# EasyEDA Pro project zhuban.epro, board PCB4
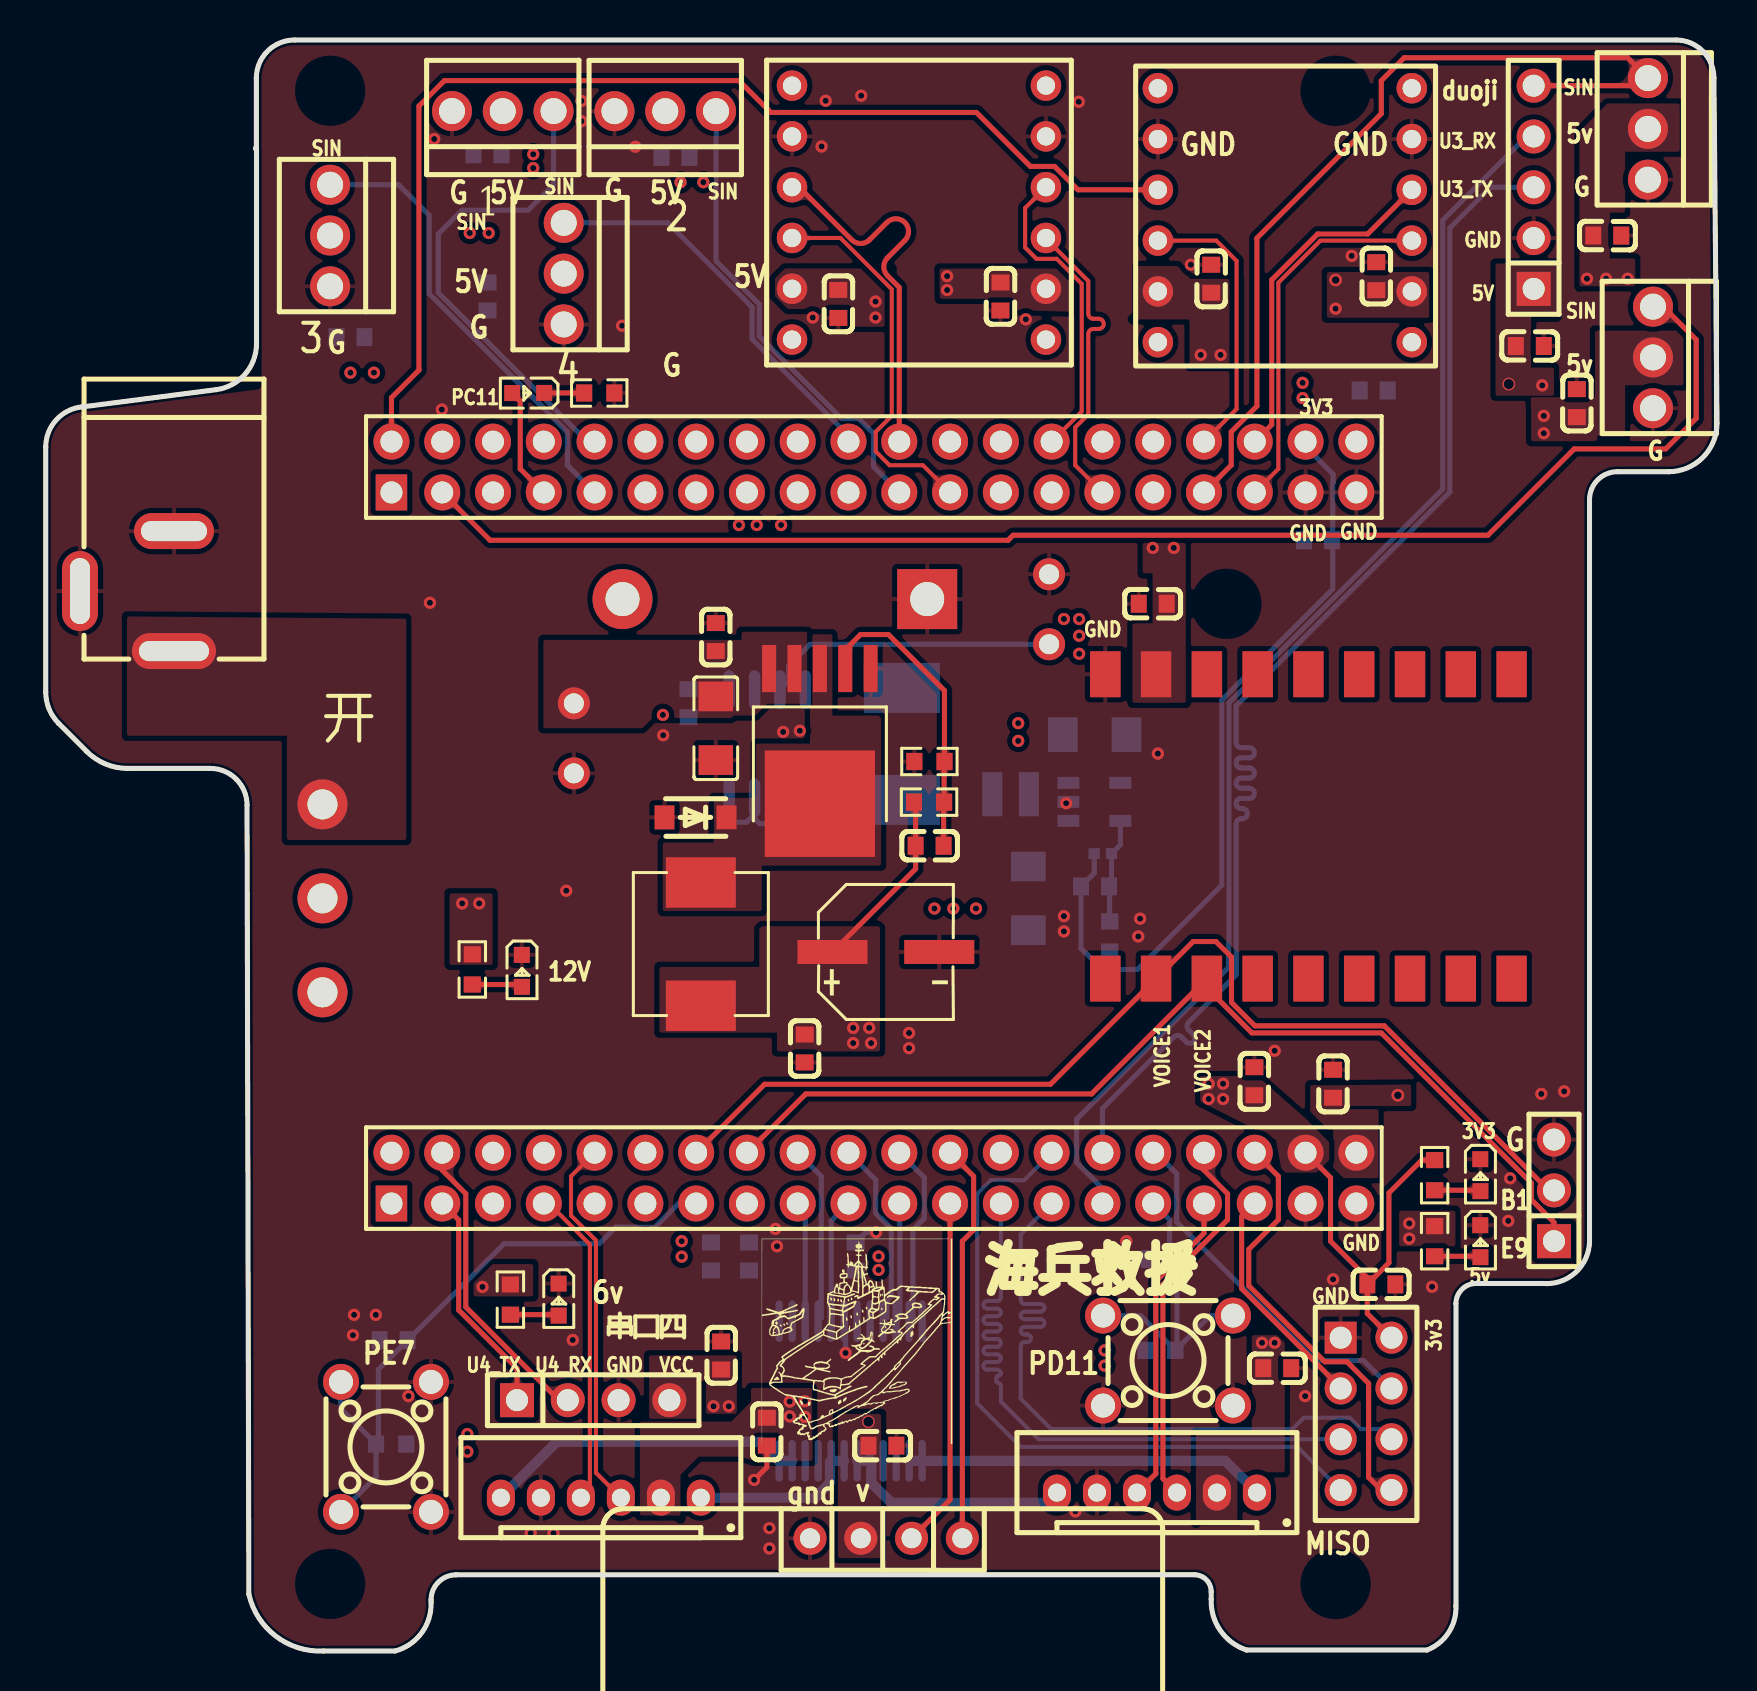
[diagram p5: board, top side]
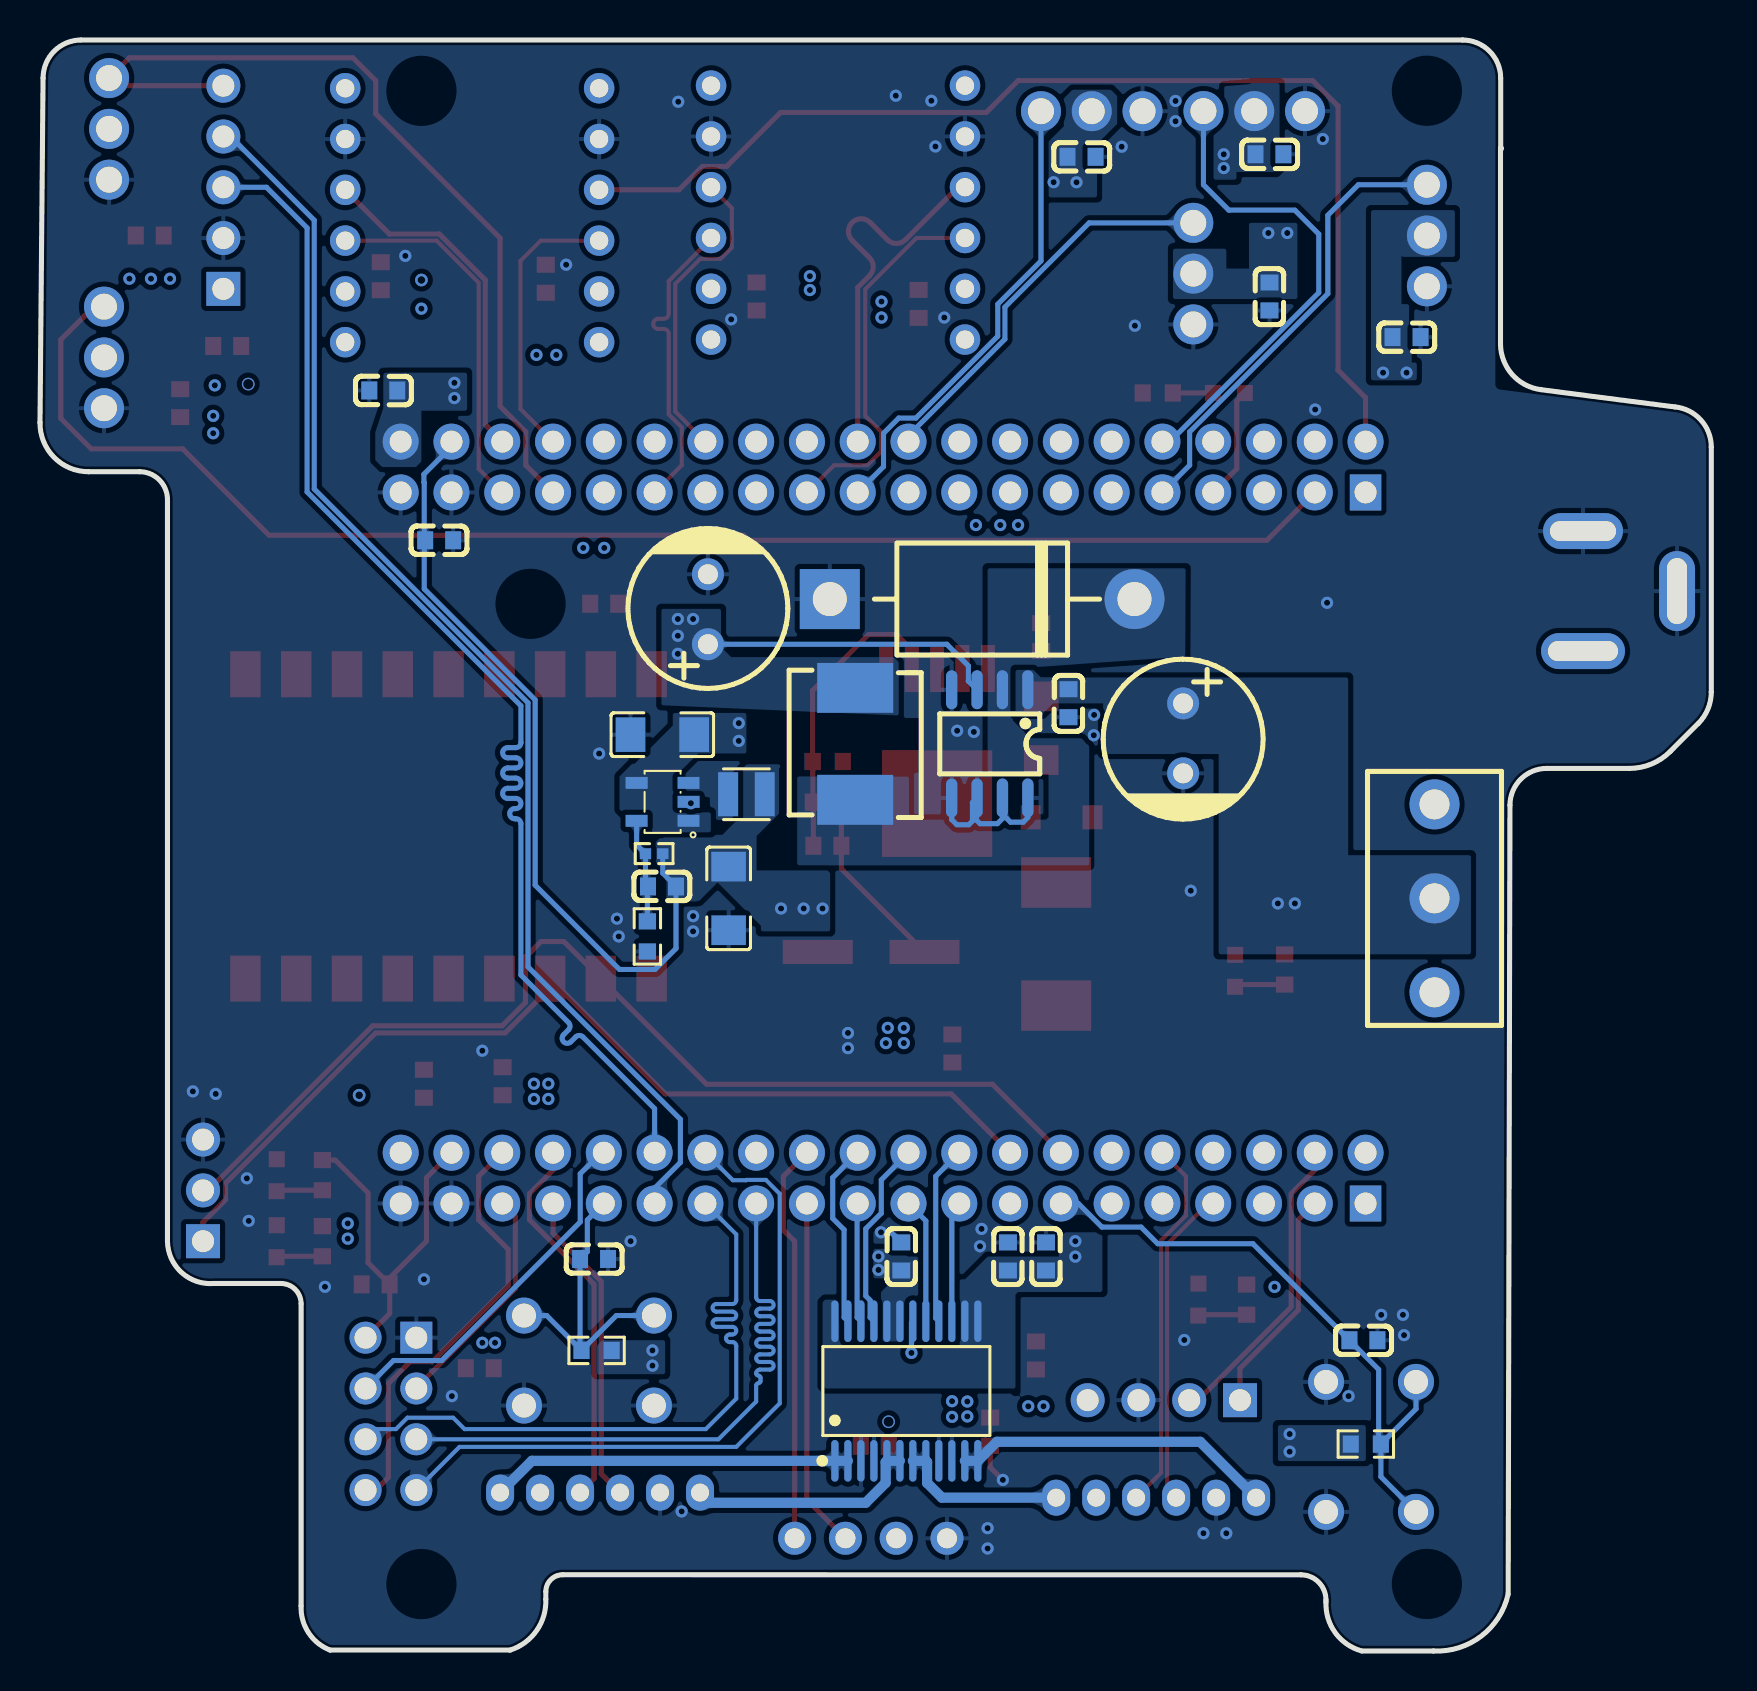
[diagram p6: board, bottom side, seen from below]

Outline 83.59 x 80.57 mm; copper layers: Top Layer, Inner1, Inner2, Bottom Layer. Coordinates in mm from the lower left corner of the outline.
Outline path: 0,60.21 0,47.96 arc(0.17,47.11) 0.65,46.39 2.05,44.98 arc(2.99,44.36) 4.1,44.14 8.23,44.14 arc(9.53,43.6) 10.07,42.3 10.16,2.84 arc(11.51,0.74) 13.89,0 17.48,0 arc(18.8,0.9) 19.27,2.43 19.27,2.56 arc(19.64,3.44) 20.53,3.81 57.45,3.81 arc(58.05,3.57) 58.29,2.97 58.29,2.59 arc(58.76,1.02) 60.07,0.05 69.09,0.05 arc(70.16,0.92) 70.53,2.25 70.53,17.37 arc(70.83,18.08) 71.55,18.38 74.89,18.38 arc(76.51,18.92) 77.22,20.48 77.22,57.58 arc(77.63,58.57) 78.61,58.98 81.17,58.98 arc(82.89,59.69) 83.59,61.42 83.44,78.66 arc(82.88,80.01) 81.53,80.57 12.44,80.57 arc(11.09,80) 10.53,78.65 10.53,75.17 arc(10.49,75.13) 10.54,75.1 10.54,65.37 arc(9.97,63.85) 8.52,63.08 1.83,62.22 arc(0.52,61.56) 0,60.21
Stack: Top Layer 0.035mm 外层铜厚1oz / Dielectric1 0.2104mm 7628 RC49% 8.6mil / Inner1 0.0152mm 内层铜厚 / Dielectric2 1.065mm 1.1mm H/HOZ Copper / Inner2 0.0152mm 内层铜厚 / Dielectric3 0.2104mm 7628 RC49% 8.6mil / Bottom Layer 0.035mm 外层铜厚1oz

## Design rules (mm)
template: 自定义配置
spacing copperThickness1oz (default): track to track 0.102, other pairs 0.152 to 0.3
spacing copperThickness2oz: track to track 0.203, other pairs 0.152 to 0.3
track width copperThickness1oz (default): min 0.127, default 0.254, max 2.54
track width copperThickness2oz: min 0.203, default 0.254, max 2.54
differential pair differentialPair (default): width min 0.127, default 0.254, max 2.54; gap min 0.152, default 0.152
via viaSize (default): diameter min 0.5, default 0.61, max 10; hole min 0.3, default 0.305, max 6.3
net 12V uses ASD
net 5V2A uses AS
net 3V3 uses ASD
net $3N5292 uses ASD
net $3N121 uses AS
net $3N6658 uses ASD
net $3N5291 uses ASD
net 6V uses ASD
net $3N20136 uses ASD

## Placement (name value [footprint] x y rotation side)
C7  1uF  [C0603]  32.15 47.4 90 bottom
C8  180uF  [CAP-TH_BD8.0-P3.50-D0.6-FD]  50.19 52.1 90 bottom
C9  470uF  [CAP-TH_BD8.0-P3.50-D0.6-FD_1]  26.42 45.64 270 bottom
C25  22uF  [C1206]  52.47 45.83 180 bottom
C26  22uF  [C1206]  49.15 37.64 270 bottom
C27  100pF  [C0603]  52.48 38.24 180 bottom
C33  100nF  [C0603]  35.18 19.73 90 bottom
C34  10uF  [C0603]  33.27 19.73 90 bottom
C35  100nF  [C0603]  40.51 19.73 90 bottom
C39  100nF  [C0603]  58.29 68.63 90 top
C40  100nF  [C0603]  74.23 65.26 0 top
C42  100nF  [C0603]  22.1 74.85 0 bottom
C43  100nF  [C0603]  66.55 68.75 270 top
C44  100nF  [C0603]  31.5 74.72 0 bottom
C45  100nF  [C0603]  22.1 67.74 90 bottom
C46  100nF  [C0603]  15.24 65.71 0 bottom
C48  100nF  [C0603]  61.59 14.14 180 top
C49  100nF  [C0603]  36.07 10.97 90 top
C55  100nF  [C0603]  17.4 15.54 0 bottom
C56  100nF  [C0603]  55.88 19.61 0 bottom
C58  100nF  [C0603]  47.75 67.74 270 top
C59  100nF  [C0603]  39.64 67.37 270 top
C64  100nF  [C0603]  41.85 10.27 180 top
C65  100nF  [C0603]  33.78 14.78 270 top
C66  100nF  [C0603]  66.8 18.34 0 top
C67  100nF  [C0603]  64.39 28.37 90 top
C68  100nF  [C0603]  60.45 28.5 90 top
C69  100nF  [C0603]  66.42 63.04 0 bottom
C70  100nF  [C0603]  63.63 55.55 180 bottom
C71  100nF  [C0603]  55.37 52.37 0 top
C72  100uF  [C1206]  33.51 46.15 90 top
C73  1uF  [C0603]  33.51 50.71 270 top
C74  2.7nF  [C0603]  44.21 40.27 0 top
C75  220uF  [CAP-SMD_BD6.3-L6.6-W6.6-LS7.2-FD]  42.02 34.96 0 top
C76  1uF  [C0603]  37.96 30.13 270 top
C77  100nF  [C0603]  78.1 70.79 180 top
C78  100nF  [C0603]  76.58 62.4 270 top
CN1  PH2.0-6P  [PH2.0-6P 直针端子座]  60.58 7.92 180 top
CN3  PH2.0-6P  [PH2.0-6P 直针端子座]  32.77 7.67 180 top
CN5  640456-3  [CONN-TH_640456-3]  14.22 70.79 90 top
CN6  640456-3  [CONN-TH_640456-3]  25.91 68.88 90 top
CN7  640456-3  [CONN-TH_640456-3]  22.86 77.01 0 top
CN8  640456-3  [CONN-TH_640456-3]  30.99 77.01 0 top
CN14  640456-3  [CONN-TH_640456-3]  80.14 76.12 90 top
CN15  640456-3  [CONN-TH_640456-3]  80.39 64.69 90 top
D1  SK32WA  [SOD-123F_L2.8-W1.8-LS3.7-RD]  32.5 41.69 180 top
DC1  DC-005-5A-2.0  [DC-IN-TH_DC-005-5A-2.0]  4.06 53.01 270 top
H2  PZ254V-11-03P  [HDR-TH_3P-P2.54-V-M]  75.44 23.03 90 top
H3  PZ254V-11-05P  [HDR-TH_5P-P2.54-V-M]  74.42 73.2 90 top
L2  68uH  [IND-SMD_L7.1-W6.6-1]  42.82 45.37 270 bottom
L3  2.2uH  [IND-SMD_L2.5-W2.0_MHCD252012A]  48.26 42.85 180 bottom
L4  22uH  [IND-SMD_L7.0-W6.6_FXL0650]  32.77 35.35 270 top
LED1  XL-1608SURC-06  [LED0603-RD_RED]  25.65 17.57 270 top
LED3  XL-1608SURC-06  [LED0603-RD_RED]  71.75 20.49 270 top
LED9  XL-1608SURC-06  [LED0603-RD_RED]  71.75 23.8 270 top
LED10  XL-1608SURC-06  [LED0603-RD_RED]  24.13 62.91 180 top
LED11  XL-1608SURC-06  [LED0603-RD_RED]  23.82 34.01 270 top
OLED1  -  [0.96OLED_4P]  42.04 5.64 0 top
R5  10kΩ  [R0603]  69.47 20.49 270 top
R29  10kΩ  [R0603]  17.28 10.35 0 bottom
R31  450kΩ  [R0402]  52.88 39.87 180 bottom
R32  100kΩ  [R0603]  53.21 35.73 270 bottom
R45  10kΩ  [R0603]  69.47 23.8 270 top
R46  10kΩ  [R0603]  27.69 62.91 0 top
R47  10kΩ  [R0603]  55.75 15.03 180 bottom
R49  10kΩ  [R0603]  23.24 17.57 270 top
R50  2kΩ  [R0603]  44.2 44.48 0 top
R51  13kΩ  [R0603]  44.18 42.45 0 top
R52  10kΩ  [R0603]  21.34 34.08 270 top
SW4  K2-1102DP-Z4SW-04  [SW-TH_4P-L6.0-W6.0-P4.50-LS6.5]  17.02 10.21 90 top
SW5  K2-1102DP-Z4SW-04  [SW-TH_4P-L6.0-W6.0-P4.50-LS6.5]  56.13 14.53 0 top
U2  2.54-2*4  [HDR-TH_8P-P2.54-V-F-R2-C4-S2.54]  66.04 11.86 270 top
U3  XL1509-5.0E1  [SOIC-8_L5.0-W4.0-P1.27-LS6.0-BL]  36.09 45.37 0 bottom
U4  1N5820-E3/54  [DO-201AD_BD5.3-L8.4-P12.50-D1.4-FD]  36.47 52.61 180 bottom
U23  WTH01  [JY901]  43.07 71.68 180 top
U24  ME3103AM5G  [SOT-23-5_L3.0-W1.7-P0.95-LS2.8-BR]  52.45 42.47 180 bottom
U28  TB6612FNG(O,C,8,EL  [SSOP-24_L8.4-W5.8-P0.65-LS7.8-BL]  40.26 13 180 bottom
U31  PZ2.54-2*20  [HDR-TH_40P-P2.54-V-M-R2-C20-S2.54]  41.42 59.21 0 top
U32  PZ2.54-2*20  [HDR-TH_40P-P2.54-V-M-R2-C20-S2.54]  41.42 23.65 0 top
U34  JY901  [JY901#2]  64.52 69.26 180 top
U35  PM254-1-04-Z-8.5  [HDR-TH_4P-P2.54-V-F]  27.38 12.54 0 top
U36  PM254-2-09-Z-8.5  [HDR-TH_18P-P2.54-V-F-R2-C9-S2.54]  59.44 39.93 90 top
U38  -  [电源开关]  13.84 37.64 270 bottom
U39  XL4003E1  [TO-252-5_L6.5-W5.6-P1.27-LS9.5-TL]  38.72 45.75 270 top

## Footprints (pads in the part's own frame, mm; a bottom-side part is the same pattern mirrored in y, then rotated)
0.96OLED_4P
  round 1.651 hole 1.001: 1(-3.81,0) 2(-1.27,0.003) 3(1.27,0.003) 4(3.81,0.003)
C0603
  rect 0.8x0.9 smd: 1(-0.7,0) 2(0.7,0)
C1206
  rect 1.485x1.728 smd: 1(-1.593,0) 2(1.593,0)
CAP-SMD_BD6.3-L6.6-W6.6-LS7.2-FD
  rect 3.5x1.2 smd: 1(-2.67,0) 2(2.67,0)
CAP-TH_BD8.0-P3.50-D0.6-FD
  round 1.6 hole 1: 1(-1.75,0) 2(1.75,0)
CAP-TH_BD8.0-P3.50-D0.6-FD_1
  round 1.6 hole 1: 1(-1.75,0) 2(1.75,0)
CONN-TH_640456-3
  round 2 hole 1.3: 1(-2.54,0) 2(0,0) 3(2.54,0)
DC-IN-TH_DC-005-5A-2.0
  oval 1.8x4.2 hole 1x3.5: 1(3,2.352)
  oval 1.8x4 hole 1x3.3: 2(-3,2.352)
  oval 4x1.8 hole 3.3x1: 3(-0.001,-2.352)
DO-201AD_BD5.3-L8.4-P12.50-D1.4-FD
  rect 3x3 hole 1.7: 1(-7.62,0)
  round 3 hole 1.7: 2(7.62,0)
HDR-TH_3P-P2.54-V-M
  rect 1.7x1.7 hole 1.1: 1(-2.54,0)
  round 1.7 hole 1.1: 2(0,0) 3(2.54,0)
HDR-TH_4P-P2.54-V-F
  rect 1.7x1.7 hole 1.1: 1(-3.81,0)
  round 1.7 hole 1.1: 2(-1.27,0) 3(1.27,0) 4(3.81,0)
HDR-TH_5P-P2.54-V-M
  rect 1.7x1.7 hole 1.1: 1(-5.08,0)
  round 1.7 hole 1.1: 2(-2.54,0) 3(0,0) 4(2.54,0) 5(5.08,0)
HDR-TH_8P-P2.54-V-F-R2-C4-S2.54
  rect 1.6x1.6 hole 1.1: 1(-3.81,-1.27)
  round 1.6 hole 1.1: 2(-3.81,1.27) 3(-1.27,-1.27) 4(-1.27,1.27) 5(1.27,-1.27) 6(1.27,1.27) 7(3.81,-1.27) 8(3.81,1.27)
HDR-TH_18P-P2.54-V-F-R2-C9-S2.54
  rect 2.3x1.524 smd: 1(-6.299,6.439) 2(-6.299,3.899) 3(-6.299,1.359) 4(-6.299,-1.181) 5(-6.299,-3.721) 6(-6.299,-6.261) 7(-6.299,-8.801) 8(-6.299,-11.341) 9(-6.299,-13.881) 10(8.921,-13.881) 11(8.921,-11.341) 12(8.921,-8.801) 13(8.921,-6.261) 14(8.921,-3.721) 15(8.921,-1.181) 16(8.921,1.359) 17(8.921,3.899) 18(8.921,6.439)
HDR-TH_40P-P2.54-V-M-R2-C20-S2.54
  rect 1.575x1.8 hole 1.1: 1(-24.13,-1.27)
  round 1.8 hole 1.1: 2(-24.13,1.27) 3(-21.59,-1.27) 4(-21.59,1.27) 5(-19.05,-1.27) 6(-19.05,1.27) 7(-16.51,-1.27) 8(-16.51,1.27) 9(-13.97,-1.27) 10(-13.97,1.27) 11(-11.43,-1.27) 12(-11.43,1.27) 13(-8.89,-1.27) 14(-8.89,1.27) 15(-6.35,-1.27) 16(-6.35,1.27) 17(-3.81,-1.27) 18(-3.81,1.27) 19(-1.27,-1.27) 20(-1.27,1.27) 21(1.27,-1.27) 22(1.27,1.27) 23(3.81,-1.27) 24(3.81,1.27) 25(6.35,-1.27) 26(6.35,1.27) 27(8.89,-1.27) 28(8.89,1.27) 29(11.43,-1.27) 30(11.43,1.27) 31(13.97,-1.27) 32(13.97,1.27) 33(16.51,-1.27) 34(16.51,1.27) 35(19.05,-1.27) 36(19.05,1.27) 37(21.59,-1.27) 38(21.59,1.27) 39(24.13,-1.27) 40(24.13,1.27)
IND-SMD_L2.5-W2.0_MHCD252012A
  rect 1x2.2 smd: 1(0.913,0) 2(-0.913,0)
IND-SMD_L7.0-W6.6_FXL0650
  rect 2.524x3.5 smd: 1(3.078,0) 2(-3.078,0)
IND-SMD_L7.1-W6.6-1
  rect 2.5x3.8 smd: 1(-2.8,0) 2(2.8,0)
JY901
  round 1.524 hole 0.914: 1(-6.954,6.1) 2(-6.954,3.56) 3(-6.954,1.02) 4(-6.954,-1.52) 5(-6.954,-4.06) 6(-6.954,-6.6) 7(5.747,-6.6) 8(5.747,-4.06) 9(5.747,-1.52) 10(5.747,1.02) 11(5.747,3.56) 12(5.747,6.1)
JY901#2
  round 1.524 hole 0.914: 1(-3.81,3.81) 2(-3.81,1.27) 3(-3.81,-1.27) 4(-3.81,-3.81) 5(-3.81,-6.35) 6(-3.81,-8.89) 7(8.89,-8.89) 8(8.89,-6.35) 9(8.89,-3.81) 10(8.89,-1.27) 11(8.89,1.27) 12(8.89,3.81)
LED0603-RD_RED
  rect 0.8x0.8 smd: 1(-0.799,-0.004) 2(0.799,0.004)
PH2.0-6P 直针端子座
  oval 1.4x1.8 hole 0.9: 1(0,0) 2(2,0) 3(4,0) 4(6,0) 5(8,0) 6(10,0)
R0402
  rect 0.566x0.54 smd: 1(-0.433,0) 2(0.433,0)
R0603
  rect 0.806x0.864 smd: 1(-0.753,0) 2(0.753,0)
SOD-123F_L2.8-W1.8-LS3.7-RD
  rect 1x1.2 smd: 1(-1.55,0) 2(1.55,0)
SOIC-8_L5.0-W4.0-P1.27-LS6.0-BL
  oval 0.569x1.95 smd: 1(-1.905,-2.705) 2(-0.635,-2.705) 3(0.635,-2.705) 4(1.905,-2.705) 5(1.905,2.705) 6(0.635,2.705) 7(-0.635,2.705) 8(-1.905,2.705)
SOT-23-5_L3.0-W1.7-P0.95-LS2.8-BR
  rect 1.1x0.6 smd: 1(1.3,-0.95) 2(1.3,0) 3(1.3,0.95) 4(-1.3,0.95) 5(-1.3,-0.95)
SSOP-24_L8.4-W5.8-P0.65-LS7.8-BL
  oval 0.364x2.082 smd: 1(-3.575,-3.491) 2(-2.925,-3.491) 3(-2.275,-3.491) 4(-1.625,-3.491) 5(-0.975,-3.491) 6(-0.325,-3.491) 7(0.325,-3.491) 8(0.975,-3.491) 9(1.625,-3.491) 10(2.275,-3.491) 11(2.925,-3.491) 12(3.575,-3.491) 13(3.575,3.491) 14(2.925,3.491) 15(2.275,3.491) 16(1.625,3.491) 17(0.975,3.491) 18(0.325,3.491) 19(-0.325,3.491) 20(-0.975,3.491) 21(-1.625,3.491) 22(-2.275,3.491) 23(-2.925,3.491) 24(-3.575,3.491)
SW-TH_4P-L6.0-W6.0-P4.50-LS6.5
  round 1.8 hole 1.2: 1(-3.25,2.25) 2(3.25,2.25) 3(-3.25,-2.25) 4(3.25,-2.25)
TO-252-5_L6.5-W5.6-P1.27-LS9.5-TL
  rect 2.357x0.7 smd: 1(-3.378,2.54) 2(-3.378,1.27) 3(-3.378,0) 4(-3.378,-1.27) 5(-3.378,-2.54)
  rect 5.324x5.512 smd: 6(3.378,0)
电源开关
  round 2.5 hole 1.5: 1(-4.7,0) 2(0,0) 3(4.7,0)

## Nets
As in the schematic, except:
$3N5291: L3.2 U24.3
$3N5292: C27.1 R31.1 R32.1 U24.5

Pads without a net: U23 1 6 7 12; U32 2; U34 1 6 7 12; U36 1 4 5 6 7 8 9 10 11 12 13 14 15 16; U38 3

## Via types
v1: diameter 0.61, hole 0.305, Top Layer to Bottom Layer, 118 vias
v2: diameter 0.635, hole 0.508, Top Layer to Bottom Layer, 2 vias
v3: diameter 0.635, hole 0.381, Top Layer to Bottom Layer, 2 vias

## Routing (per net, layer and track width the routed paths; a pad name or vN(x,y) marks a point on that pad's centre or on a via; arc(x,y) is an arc through that point)
3V3: length 58.3
  Top Layer w0.254: U32.38 64.26,23.67 64.26,20.49 66.1,18.65 C66.1 ; C66.1 66.1,16.88 U2.2 ; C66.1 67.18,19.42 67.18,22.91 68.83,24.55 R45.1
  Bottom Layer w0.254: U31.38 63.01,60.23 64.39,58.85 64.39,58.44 64.37,58.43 64.37,53.11 58.83,47.57 58.83,38.3 54.61,34.08 52.83,34.08 51.78,35.13 C27.2 52.44,38.9 52.44,39.87
  vias: v1(44.45,37.13) v1(45.4,37.13) v1(46.53,37.13) v1(58.17,28.37) v1(58.17,27.61) v1(58.89,28.37) v1(58.89,27.61)
5V2A: length 14.9
  Bottom Layer w0.254: C8.1 38.24,50.35 37.16,49.27 37.16,48.51 U3.3
  vias: v1(15.24,63.93) v1(16.42,63.93) v1(21.09,10.85) v1(21.09,9.97) v1(21.21,70.91) v1(22.16,70.91) v1(24.38,74.85) v1(24.38,74.16) v1(31.75,73.45) v1(32.89,73.45) v1(33.4,12.24) v1(34.16,12.24) v1(34.67,56.31) v1(35.56,56.31) v1(36.78,56.31) v1(37.21,12.48) v1(37.21,11.73) v1(37.97,12.49) v1(37.97,11.71) v1(41.5,67.48) v1(41.5,66.68) v1(41.66,19.73) v1(41.66,19.06) v1(45.09,68.75) v1(45.09,68.06) v1(48.64,46.4) v1(48.64,45.51) v1(50.93,51.61) v1(51.69,51.61) v1(51.69,50.77) v1(51.69,49.87) v1(52.96,15.03) v1(52.96,14.27) v1(55.37,55.17) v1(56.42,55.17) v1(57.77,64.82) v1(58.76,64.82) v1(60.83,15.41) v1(61.47,15.41) v1(62.87,63.42) v1(62.87,62.66) v1(64.52,67.13) v1(68.2,21.38) v1(68.2,20.62) v1(74.85,63.29) v1(74.93,61.77) v1(74.93,60.9) v1(77.09,68.63) v1(78.04,68.63) v1(79.12,68.63) v2(41.15,11.47) v2(73.18,63.36) v3(64.52,68.56) v3(67.63,27.79)
6V: length 9.2
  Top Layer w0.254: C75.1 43.51,39.11 C74.1 43.51,42.37 R51.1
  vias: v1(21.84,18.21) v1(31.81,20.49) v1(31.81,19.72) v1(40.39,31.16) v1(40.39,30.4) v1(41.19,31.16) v1(41.28,30.4)
12V:
  vias: v1(20.83,37.39) v1(21.68,37.39)
GND: length 14.4
  Top Layer w0.254: v1(35.43,8.56) 36.07,9.19 C49.1
  Bottom Layer w0.254: v1(40,14.91) 40,16.42 39.93,16.49 ; 36.76,42.63 U3.6 ; 36.76,42.63 36.76,41.55 36.58,41.37 35.71,41.37 35.45,41.63 35.45,41.72 ; 36.76,42.63 36.96,42.43 36.96,41.5 37.14,41.32 37.74,41.32 37.99,41.58 U3.5 ; v1(41.53,20.94) 41.02,20.94 C35.2 ; 35.45,41.72 35.33,41.72 35.05,41.45 34.42,41.45 34.18,41.68 U3.8 ; 35.45,41.72 U3.7
  vias: v1(15.37,15.8) v1(15.42,16.81) v1(16.51,16.81) v1(18.14,12.75) v1(19.22,52.42) v1(19.43,75.61) v1(19.81,62.09) v1(24.26,5.89) v1(25.4,5.89) v1(26.03,38.02) v1(26.36,15.55) v1(26.8,77.52) v1(26.8,76.5) v1(28.83,66.28) v1(29.49,75.23) v1(30.87,46.81) v1(30.88,45.8) v1(36.19,6.14) v1(36.19,5.13) v1(36.5,21.11) v1(36.58,20.24) v1(36.88,45.96) v1(37.72,46.02) v1(38.36,66.69) v1(38.81,75.24) v1(39.01,77.53) v1(40.79,77.78) v1(43.18,30.91) v1(43.18,30.15) v1(49.02,66.6) v1(50.93,36.75) v1(50.93,35.99) v1(51.04,42.4) v1(51.5,6.98) v1(51.67,77.48) v1(54.05,20.49) v1(54.65,35.73) v1(54.74,36.62) v1(55.63,44.88) v1(57.28,69.33) v1(61.47,30.02) v1(62.99,12.75) v1(64.39,18.59) v1(65.32,69.77) v1(69.34,18.21) v1(73.15,21.51) v1(73.25,23.64) v1(74.8,27.86) v1(75.95,27.99)
AM1: length 8.5
  Bottom Layer w0.508: CN3.1 38.48,7.67 39.22,8.41 39.22,9.45 U28.8 39.93,9.51
AM2: length 16.1
  Bottom Layer w0.508: CN3.6 25.56,10.46 35.73,10.46 U28.12 U28.11
CE: length 12.1
  Top Layer w0.254: U32.35 59.82,21.72 59.82,18.12 64.77,13.17 64.77,12.62
CM1: length 11.7
  Bottom Layer w0.508: U28.6 U28.5 41.3,9.45 41.3,8.41 42.29,7.41 50.07,7.41 CN1.6
CM2: length 18.1
  Bottom Layer w0.508: CN1.1 58.99,9.51 U28.1 U28.2
CSN: length 18.7
  Bottom Layer w0.254: 67.31,12.62 U2.4 65.91,14.53 63.5,14.53 56.57,21.45 56.57,23.87 55.52,24.92 U32.32
DUOJI5: length 23.4
  Bottom Layer w0.254: CN8.3 33.53,69.51 35.69,67.35 35.69,65.75 39.78,61.66 40.64,61.66 41.4,60.9 41.4,59.23 U31.21
DUOJI6: length 22.9
  Bottom Layer w0.254: CN5.3 17.65,73.33 19.18,71.8 19.18,67.88 26.09,60.97 26.09,59.3 U31.9
DUOJI7: length 73
  Top Layer w0.254: U31.3 22.22,55.55 48.13,55.55 48.39,55.8 72.14,55.8 76.45,60.12 81.03,60.12 82.55,61.64 82.55,65.58 80.9,67.23 CN15.3
DUOJI_CAMARA: length 44.4
  Top Layer w0.254: U31.33 59.29,59.3 59.29,60.97 60.58,62.25 60.58,70.66 66.8,76.88 66.8,78.53 67.94,79.68 79.12,79.68 CN14.3 79.76,78.28 H3.5
IRQ: length 22.1
  Top Layer w0.254: U32.36 61.65,23.74 61.65,21.57 60.17,20.09 60.17,18.27 63.98,14.46 65.09,14.46 66.17,13.38 66.17,8.68 67.31,7.54
MISO: length 35
  Bottom Layer w0.203: U2.7 62.61,10.21 48.77,10.21 46.59,12.38 46.59,22.87 47.28,23.56 48.26,23.56 48.28,23.54 48.94,23.54 U32.28
MOSI: length 35
  Bottom Layer w0.203: U32.27 48.77,20.84 48.77,17.54 arc(48.82,17.41) 48.96,17.35 49.76,17.35 arc(49.95,17.16) 49.76,16.97 48.96,16.97 arc(48.77,16.78) 48.96,16.59 49.76,16.59 arc(49.95,16.4) 49.76,16.21 48.96,16.21 arc(48.77,16.02) 48.96,15.83 49.09,15.83 arc(49.28,15.64) 49.09,15.45 48.96,15.45 arc(48.82,15.39) 48.77,15.26 48.77,12.62 50.29,11.1 62.36,11.1 62.93,11.67 65.22,11.67 65.79,11.1 66.8,11.1 U2.6
PA0: length 11.4
  Top Layer w0.254: U35.1 23.57,14.13 20.66,17.05 20.66,21.56 U32.3
PA1: length 15.2
  Top Layer w0.254: U35.2 25.67,12.54 21.01,17.2 21.01,22.87 19.83,24.05 U32.4
PA6: length 16
  Top Layer w0.203: U32.7 25.17,22.38 27.22,20.33 27.22,8.12 CN3.4
PA7: length 18.8
  Top Layer w0.203: U32.10 26.27,23.74 26.27,21.78 27.52,20.53 27.52,8.91 CN3.3
PA8: length 14.1
  Top Layer w0.203: 55.59,70.5 U34.10 58.55,70.53 59.56,69.52 59.56,62.11 U31.34
PB1: length 53.8
  Top Layer w0.254: H2.2 75.18,23.03 66.95,31.26 60.48,31.26 59.31,32.43 59.31,34.7 58.53,35.48 57.39,35.48 U36.2 50.25,28.34 35.96,28.34 32.53,24.92
PB6: length 19.1
  Top Layer w0.203: U31.23 43.87,59.3 42.2,59.3 41.51,59.99 41.51,60.97 42.32,61.77 42.32,68.1 39.75,70.66 37.33,70.66
PB7: length 19.1
  Top Layer w0.254: U31.22 42.69,68.19 42.1,68.78 arc(41.92,69.23) 42.1,69.68 42.97,70.55 arc(42.97,71.44) 42.08,71.44 41.21,70.57 arc(40.76,70.39) 40.31,70.57 37.68,73.2 37.33,73.2
PB9: length 19.9
  Bottom Layer w0.254: U31.20 40.15,60.78 35.33,65.6 35.33,67.21 31.12,71.42 CN6.3
PB10: length 17.5
  Top Layer w0.254: U32.23 45.23,7.56 OLED1.3
PB11: length 20
  Top Layer w0.254: OLED1.4 45.85,20.49 46.41,21.06 46.41,23.74 U32.24
PB13: length 35
  Bottom Layer w0.203: U2.5 49.66,10.59 47.77,12.47 47.77,13.28 arc(47.74,13.36) 47.66,13.39 arc(47.58,13.42) 47.55,13.5 47.55,13.66 arc(47.58,13.74) 47.66,13.77 arc(47.74,13.81) 47.77,13.88 arc(47.72,14.02) 47.58,14.07 47.09,14.07 arc(46.9,14.26) 47.09,14.45 47.58,14.45 arc(47.77,14.64) 47.58,14.84 47.09,14.84 arc(46.9,15.03) 47.09,15.22 47.58,15.22 arc(47.77,15.41) 47.58,15.6 47.09,15.6 arc(46.9,15.79) 47.09,15.98 47.58,15.98 arc(47.77,16.17) 47.58,16.36 47.09,16.36 arc(46.9,16.55) 47.09,16.74 47.58,16.74 arc(47.77,16.93) 47.58,17.12 47.09,17.12 arc(46.9,17.31) 47.09,17.5 47.58,17.5 arc(47.72,17.56) 47.77,17.69 U32.25
PC6: length 18.5
  Top Layer w0.203: U31.35 61.65,59.12 61.65,68.43 63.75,70.53 U34.3
PC7: length 17.3
  Top Layer w0.254: U31.36 61.32,61.33 61.32,68.57 63.62,70.86 66.12,70.86 U34.4
PC9: length 57.1
  Top Layer w0.254: U34.9 51.63,73.07 50.46,74.24 49.25,74.24 46.55,76.94 36.26,76.94 34.67,78.53 19.94,78.53 18.67,77.26 18.67,64.06 17.29,62.68 U31.2
PC10: length 5.6
  Top Layer w0.254: LED10.2 23.73,62.51 23.73,59.12 U31.7
PD5: length 15.5
  Top Layer w0.203: U31.29 51.49,59.3 51.49,61.19 52.15,61.85 52.15,65.86 arc(52.22,66.04) 52.4,66.11 52.66,66.11 arc(52.92,66.37) 52.66,66.62 52.4,66.62 arc(52.22,66.7) 52.15,66.88 52.15,68.51 50.03,70.63 50.03,70.66
PD6: length 15.5
  Top Layer w0.203: 50.03,73.2 48.99,72.16 48.99,70.19 49.55,69.62 50.56,69.62 51.82,68.37 51.82,61.98 U31.28
PD8: length 64.6
  Bottom Layer w0.254: H3.3 72.26,73.2 70.23,71.17 70.23,57.96 59.54,47.27 59.54,45.43 arc(59.61,45.25) 59.79,45.18 60.2,45.18 arc(60.45,44.92) 60.2,44.67 59.79,44.67 arc(59.54,44.41) 59.79,44.16 60.2,44.16 arc(60.45,43.91) 60.2,43.65 59.79,43.65 arc(59.54,43.4) 59.79,43.14 60.2,43.14 arc(60.45,42.89) 60.2,42.64 59.79,42.64 arc(59.54,42.38) 59.79,42.13 59.85,42.13 arc(60.1,41.87) 59.85,41.62 59.79,41.62 arc(59.61,41.55) 59.54,41.37 59.54,33.81 57.16,31.43 arc(57.08,31.25) 57.16,31.07 57.41,30.82 arc(57.41,30.46) 57.05,30.46 56.8,30.71 arc(56.62,30.78) 56.44,30.71 52.85,27.12 U32.30
PD9: length 63.6
  Bottom Layer w0.254: H3.4 74.06,75.74 69.88,71.55 69.88,58.11 59.18,47.42 59.18,34.21 51.56,26.59 51.56,24.43 52.85,23.14 U32.29
PD11: length 15.6
  Bottom Layer w0.254: SW5.1 54.76,16.78 R47.1 ; SW5.2 58.25,16.78 56.58,15.11 56.58,19.61 56.22,19.97 56.22,21.56 U32.31
PD12: length 19.1
  Top Layer w0.254: U32.34 57.93,24.05 59.11,22.87 59.11,21.57 55.88,18.34 55.88,8.62 CN1.3
PD13: length 15.8
  Top Layer w0.254: CN1.4 55.52,8.87 55.52,18.48 57.93,20.89 U32.33
PE5: length 24.3
  Bottom Layer w0.254: CN7.3 25.4,73.33 24.13,72.06 20.83,72.06 19.63,70.86 19.63,67.93 27.08,60.48 U31.10
PE7: length 31.1
  Bottom Layer w0.254: R29.1 14.77,12.11 SW4.2 ; R29.1 16.64,10.46 16.64,14.08 C55.2 22.93,20.37 27.69,20.37 28.52,21.2 30.48,21.2 31.66,22.38 32.53,22.38 ; R29.1 16.53,8.71 SW4.1
PE8: length 50.7
  Top Layer w0.254: H2.1 75.44,21.44 74.31,22.57 74.31,23.4 66.8,30.91 60.33,30.91 58.42,32.82 58.42,33.28 U36.3 52.31,27.86 38.01,27.86 U32.16
PE10: length 9
  Bottom Layer w0.254: U28.16 38.79,16.65 38.79,23.74 U32.18
PE11: length 6
  Bottom Layer w0.254: U28.15 37.98,22.01 U32.17
PE12: length 9.5
  Bottom Layer w0.254: U32.20 41.51,23.56 41.51,21.89 42.29,21.11 42.29,17.76 42.07,17.54 42.07,16.68 U28.21
PE13: length 6.2
  Bottom Layer w0.254: U32.19 39.28,21.51 U28.17
PE14: length 9.3
  Bottom Layer w0.254: U32.22 43.94,23.67 43.94,21.64 43.37,21.07 43.37,16.68 U28.23
PE15: length 6
  Bottom Layer w0.254: U32.21 42.72,22.35 42.72,16.68 42.53,16.49
$1N8897: length 2
  Top Layer w0.254: LED10.1 26.93,62.92 R46.1
$3N2924: length 2.4
  Top Layer w0.254: LED1.2 25.61,16.82 R49.2
$3N3138: length 2.3
  Top Layer w0.254: LED3.2 71.71,19.74 R5.2
$3N5292: length 5.3
  Bottom Layer w0.254: U24.5 53.75,40.32 R31.1 53.31,38.36 C27.1 53.21,38.2 R32.1
$3N5298: length 2.3
  Top Layer w0.254: R45.2 71.71,23.04 LED9.2
$3N19862: length 15.2
  Top Layer w0.254: C74.2 44.91,42.43 R51.2 44.94,44.47 R50.2 44.95,48.03 42.15,50.83 40.75,50.83 40.06,50.15 40.06,49.21 U39.2
$3N21460: length 2.5
  Top Layer w0.254: LED11.2 23.7,33.33 R52.2

## Copper pours and planes (outline as drawn; the poured copper is in the pictures)
3V3 on Top Layer: 60.91,28.49 63,26.65 64.2,25.45 64.2,24.56 63.57,23.92 61.83,23.92 61.52,25.57 57.74,27.48 57.74,28.75 60.64,28.75
3V3 on Bottom Layer: 46.63,41.87 46.63,44.13 46.42,44.34 48.25,44.34 48.65,43.94 48.65,41.63 49.46,40.82 52.26,40.82 52.43,40.65 52.6,40.65 52.8,40.45 52.8,39.44 52.33,38.98 52.26,38.98 52.26,37.55 52.32,37.48 50.74,37.48 50.72,37.51 50.62,37.51 49.7,38.43 47.53,36.27 47.53,35.99 44.07,35.99 44.07,38.91 44.2,39.04 47.75,39.04 47.75,40.75
3V3 on Inner1: 44.07,37.89 47.57,37.89 47.53,35.79 60.83,28.37 62.74,26.84 63.88,25.83 63.88,24.08 63.74,23.94 61.27,23.94 61.34,24.69 61.34,25.83 57.66,25.83 57.15,26.34 52.96,26.34 50.29,29 44.07,29
5V2A on Top Layer: 37.1,67.11 36.47,67.75 36.47,68.64 36.98,69.14 42.31,69.14 42.31,66.23 42.32,66.23 40.41,66.23 40.35,66.29 40.35,67.09 40.33,67.11
5V2A on Top Layer: 60.32,15.8 61.98,15.8 61.98,8.94 59.65,8.94 59.6,8.9 59.6,6.52 57.66,6.52 57.53,6.4 57.53,10.92 60.33,10.92 60.32,11.15
5V2A on Top Layer: 74.29,66.72 75.56,66.72 75.56,69.39 72.52,69.39 72.52,62.78 75.44,62.78 75.44,64.18 74.29,64.18
5V2A on Top Layer: 35.28,13.16 38.32,13.16 38.35,9.51 35.42,9.51 34.77,9.72 32.66,9.72 31.75,8.81 31.75,6.62 31.59,6.78 29.72,6.78 29.72,11.35 29.59,11.48 34.29,11.48 35.28,12.47
5V2A on Top Layer: 54.37,66.6 54.61,66.83 54.61,69.26 56.61,69.26 57.25,68.62 59.69,68.62 59.69,64.27 59.69,64.26 57.21,64.26 57.21,66.53 57.15,66.6
5V2A on Top Layer: 74.29,62.15 74.29,60.5 77.6,60.5 77.6,60.75 78.99,60.75 78.99,63.29 81.91,63.29 81.91,66.03 77.49,66.03 77.49,62.7 74.28,62.7 74.28,62.17
5V2A on Top Layer: 67.69,20.24 70.51,20.24 70.51,22.02 67.69,22.02
5V2A on Top Layer: 79.5,68.25 76.75,68.25 76.73,68.23 76.71,68.25 76.71,75.99 78.1,77.39 81.73,77.39 81.73,75.04 81.79,74.98 78.99,74.98 78.99,71.93 78.23,71.93 78.23,69.65 78.23,69.64 79.5,69.64
5V2A on Top Layer: 44.7,69.14 50.8,69.14 51.31,68.63 51.31,66.98 48.46,67.06 48.46,67.62 44.72,67.62
5V2A on Top Layer: 69.2,66.68 64.08,66.68 64.08,68.96 69.2,68.96
5V2A on Top Layer: 34.57,14.79 34.57,11.89 34.54,11.86 33.02,11.86 33.02,13.51 32.68,13.51 32.67,13.5 32.67,11.61 30.18,11.61 30.18,14.78 30.18,14.79
5V2A on Top Layer: 68.3,28.33 64.77,28.3 63.25,28.3 63.25,26.97 64.13,26.08 64.39,26.08 64.39,24.18 64.92,23.65 66.66,23.65 66.66,27.1 65.15,27.1 65.15,27.26 68.3,27.26
5V2A on Top Layer: 41.78,11.86 41.78,9.36 41.78,9.36 41.78,4.64 39.62,4.64 39.62,11.86
5V2A on Top Layer: 54.86,55.67 57.02,55.67 57.02,47.42 54.48,47.42 54.36,47.42 54.36,51.4 55.36,51.4 55.36,53.9 54.86,53.9
5V2A on Bottom Layer: 21.77,73.96 21.59,74.13 21.59,78.41 22.99,78.41 23.13,78.35 24.37,78.26 24.37,76.39 24.89,75.87 24.89,73.58 23.75,73.58 23.75,73.96 21.77,73.96
5V2A on Bottom Layer: 17.28,9.5 21.68,9.5 21.68,11.3 17.35,11.3 17.28,11.3
5V2A on Bottom Layer: 40.89,49.7 49.02,49.7 49.53,50.21 49.53,52.12 52.51,52.12 52.51,47.3 40.64,46.78 40.64,49.45
5V2A on Bottom Layer: 14.73,63.55 17.02,63.55 17.02,72.06 12.83,72.06 12.83,69.72 15.44,69.72 15.49,69.77 15.49,67.36 15.11,67.36 15.11,65.07 14.99,64.95 14.99,64.44 14.74,64.44 14.73,64.43
5V2A on Bottom Layer: 33.27,72.69 30.72,72.69 30.72,75.36 29.72,76.37 29.72,77.77 30.03,78.08 31.95,78.08 32.38,77.64 32.38,76.25 33.27,75.36
5V2A on Bottom Layer: 41.53,17.95 41.53,15.22 40.26,15.22 40.26,17.63 39.59,17.63 39.59,19.72 40.14,19.72 41.36,20.11 42.04,20.11 42.04,18.78 41.89,18.64 41.23,18.64 41.23,18.25
5V2A on Bottom Layer: 52.32,15.54 55.75,15.54 55.75,13.85 52.32,13.85
5V2A on Bottom Layer: 62.23,63.93 66.17,63.93 66.42,63.92 66.42,62.15 66.82,60.95 66.82,59.55 66.48,59.21 64.79,59.21 64.52,59.48 64.52,62.02 62.23,62.02
5V2A on Bottom Layer: 51.94,46.91 48.26,46.91 48.26,44.89 50.67,44.89 51.56,43.99 51.56,42.03 51.48,41.94 50.04,41.94 50.04,40.94 53.09,40.94 53.09,41.7 54.23,41.7 54.61,42.08 54.61,43.74 53.97,44.37 53.85,44.37 51.94,46.28
5V2A on Bottom Layer: 20.7,71.42 23.12,71.42 23.12,69.14 24.26,69.14 24.26,70.13 26.9,70.13 26.92,70.15 26.92,67.61 20.73,67.61 20.7,67.64
5V2A on Inner1: 20.49,64.47 20.53,69.41 20.53,75.99 32.33,75.99 33.56,75.99 33.56,73.07 23.28,73.07 23.28,65.12 38.93,65.12 38.93,69.35 38.9,69.38 48.67,69.38 48.69,69.4 48.69,64.66 48.21,64.19 46.83,64.19 46.6,61.9 27.16,61.9 27.05,56.94 66.51,56.94 66.51,61.55 66.42,61.64 56.13,61.64 56.13,69.01 66.29,69.01 66.29,66.35 75.06,66.35 76.33,67.61 76.33,69.61 79.6,69.61 79.6,63.17 75.56,63.17 75.56,52.78 70.87,52.78 70.87,18.81 63.78,18.92 63.78,17.34 61.98,15.54 61.98,15.03 60.41,15.03 60.41,17.95 51.53,17.95 51.53,15.38 53.47,15.38 53.47,13.76 48.39,13.76 48.13,14.02 48.13,8.85 48.17,8.81 20.4,8.81 20.4,11.48 32.89,11.48 32.89,12.75 45.47,12.75 45.47,17.95 45.21,18.21 39.91,18.21 39.91,20.11 44.04,20.11 44.91,20.98 61.4,20.98 61.4,23.73 66.55,23.78 66.55,26.34 63.35,26.34 63.35,44.4 49.76,44.4 46.82,46.28 38.1,46.28 38.1,54.4 37.97,54.53 37.86,54.56 12.14,54.56 12.14,64.47
6V on Top Layer: 21.39,18.39 22.35,19.35 24.38,19.35 24.38,17.74 21.39,17.74
6V on Top Layer: 35.81,36.24 35.69,36.12 35.69,34.21 30.69,34.21 30.69,30.93 36.58,30.93 36.58,29.98 41.73,29.98 41.73,36.17 41.66,36.24
6V on Bottom Layer: 32.31,20.94 32.63,20.62 32.63,19.72 36.19,19.72 37.32,18.59 37.59,18.59 37.59,15.24 37.61,15.22 43.37,15.22 43.43,15.29 43.43,17.45 43.56,17.57 44.32,17.57 44.45,17.45 44.45,13.26 44.32,13.13 34.93,13.13 34.8,13 34.8,17.83 34.67,17.95 30.45,17.95 30.45,20.94
6V on Inner1: 32.72,18.12 32.72,19.73 32.56,20.01 32.45,21.22 16.24,21.22 16.24,26.49 41.91,26.33 41.91,32.18 11.81,32.18 11.81,17.57 26.13,17.57 26.13,18.12
12V on Top Layer: 20.19,37.89 22.35,37.89 22.35,34.31 20.22,34.31 20.19,34.34
12V on Top Layer: 24.89,46.15 29.84,46.15 30.35,46.66 34.29,46.66 34.42,46.78 35.5,46.78 36.09,47.37 38.08,47.37 38.08,50.97 34.8,50.97 34.8,50.57 24.89,50.57
12V on Bottom Layer: 24.64,44.86 24.64,34.85 12.02,34.85 12.02,39.8 18.16,39.8 18.16,48.69 31.52,48.69 31.53,48.7 33.54,48.7 33.91,49.07 34.8,49.07 34.8,46.91 34.84,46.87 33.46,46.87 32.93,47.39 30.42,47.39 30.42,44.86
GND on Top Layer: -26.67,104.31 109.6,104.31 136.14,77.77 136.14,24.18 96.14,-15.83 -18.03,-15.83 -26.67,-7.19
GND on Bottom Layer: -22.86,92.88 135.38,92.88 137.03,94.54 137.03,10.08 112.01,-14.94 -14.99,-14.94 -22.86,-7.06
GND on Inner2: -19.94,88.57 161.8,88.57 163.07,87.3 163.07,49.2 97.41,-16.46 -11.68,-16.46 -19.94,-8.21
$3N121 on Top Layer: 4.06,51.74 4.06,45.77 12.06,45.77 12.06,40.56 18.03,40.56 18.03,51.63
$3N5291 on Bottom Layer: 48.59,44.51 51.04,44.51 51.81,43.74 51.81,43.12 51.39,42.7 50.14,42.7 50.08,42.64 50.08,41.82 49.82,41.56 48.82,41.56 48.59,41.79
$3N6658 on Bottom Layer: 26.29,54.15 36.19,54.15 36.19,43.86 33.15,43.86 33.15,41.7 33.27,41.58 40.13,41.58 40.13,43.74 45.72,43.74 45.72,39.29 31.12,39.29 31.12,45.26 31.5,45.64 34.04,45.64 34.93,46.53 34.93,49.12 26.31,49.73
$3N20136 on Top Layer: 38.23,50.85 38.23,45.38 35.52,45.38 35.52,42.72 35.45,42.66 33.42,42.66 33.42,40.94 33.4,40.92 33.4,40.43 30.86,40.43 30.86,37 35.81,37 35.81,39.27 41.78,39.27 41.78,46.66 41.66,46.78 39.35,46.78 39.35,50.82 39.32,50.85

Small or netless copper shapes (teardrops, artwork), in the pictures only: 71 on Top Layer, 73 on Bottom Layer

## Text on the board
Top Silkscreen Layer: VOICE2 | 3v3 | GND | 5v | 5V | U4_TX | U4_RX | VCC | U3_TX | VOICE1 | U3_RX | SIN | PC11 | 3V3 | 12V | duoji | B1 | E9 | G | PE7 | 6v | gnd | PD11 | MISO | v | 3 | 4 | 2 | 串口四 | 1 | 海兵救援 | 开
